# Altium schematic sheet STM32F4.SchDoc: STM32F4
size B; Organization: Drexel University; Address1: ECE Senior Design; Address2: 2018-2019; Address3: ECE-08; Revision: 1.0; SheetNumber: 8; SheetTotal: 9
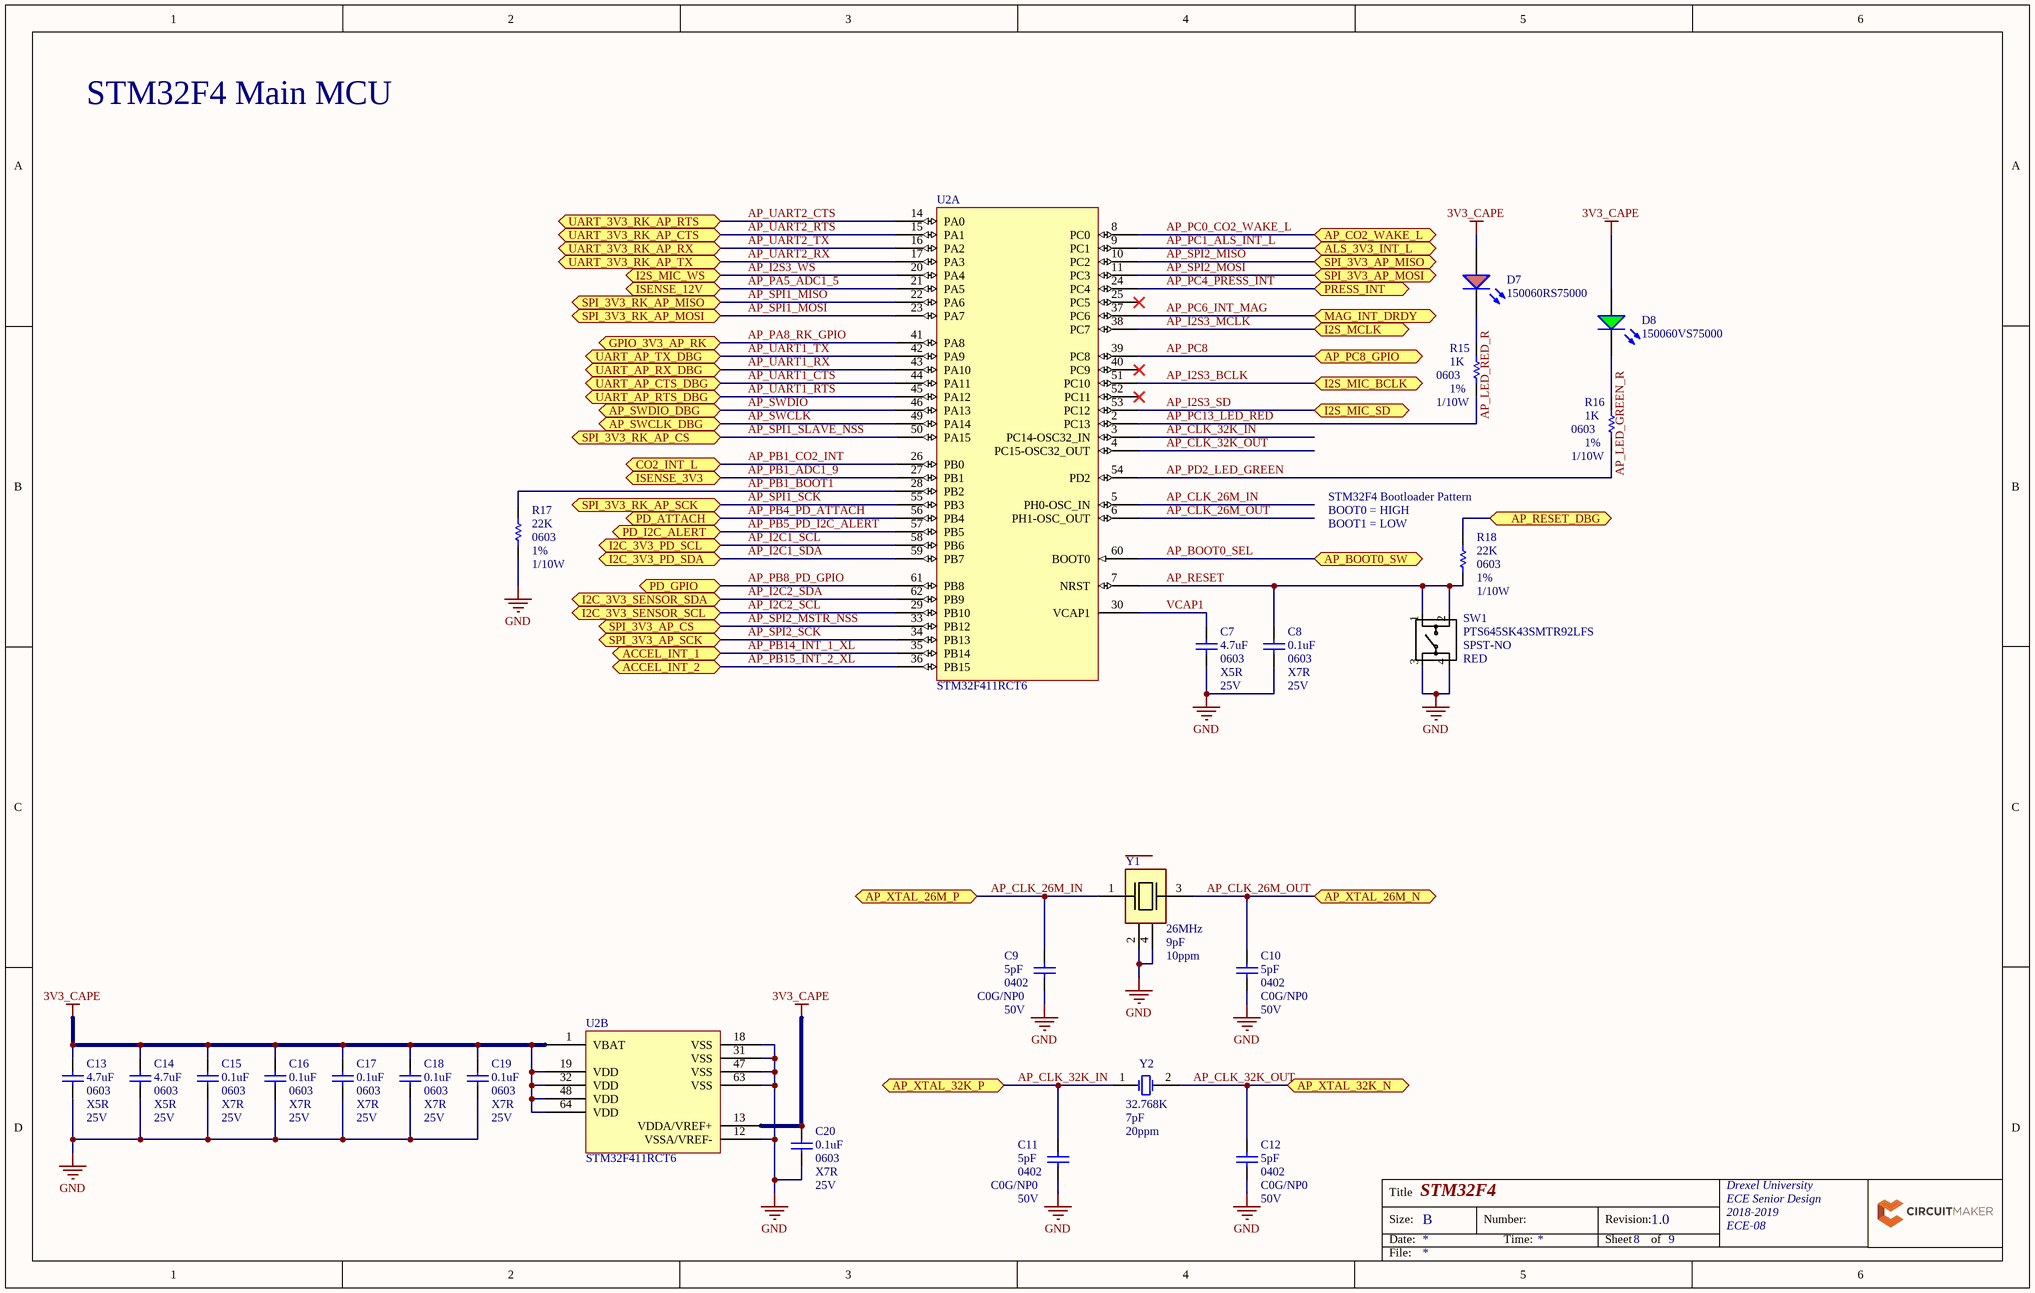
[diagram p0: STM32F4.SchDoc]

## Parts
C7  Capacitance: 4.7uF  Case/Package: 0603  Dielectric Characteristic: X5R  Voltage Rating (DC): 25V  [CAPC1608X90X35ML10T15]  (hidden comment: Murata GRM188R61E475KE11D)
C8  Dielectric Characteristic: X7R  Voltage Rating (DC): 25V  Capacitance: 0.1uF  Package: 0603  [PCB-8usp83j76ntw2xroyu3n-1]  (hidden comment: Würth Elektronik 885012206071)
C9  Capacitance: 5pF  Case/Package: 0402  Dielectric Characteristic: C0G/NP0  Voltage Rating (DC): 50V  [CAPC1005X56X25ML10T15]  (hidden comment: AVX Interconnect / Elco 04025A5R0CAT2A)
C10  Capacitance: 5pF  Case/Package: 0402  Dielectric Characteristic: C0G/NP0  Voltage Rating (DC): 50V  [CAPC1005X56X25ML10T15]  (hidden comment: AVX Interconnect / Elco 04025A5R0CAT2A)
C11  Capacitance: 5pF  Case/Package: 0402  Dielectric Characteristic: C0G/NP0  Voltage Rating (DC): 50V  [CAPC1005X56X25ML10T15]  (hidden comment: AVX Interconnect / Elco 04025A5R0CAT2A)
C12  Capacitance: 5pF  Case/Package: 0402  Dielectric Characteristic: C0G/NP0  Voltage Rating (DC): 50V  [CAPC1005X56X25ML10T15]  (hidden comment: AVX Interconnect / Elco 04025A5R0CAT2A)
C13  Capacitance: 4.7uF  Case/Package: 0603  Dielectric Characteristic: X5R  Voltage Rating (DC): 25V  [CAPC1608X90X35ML10T15]  (hidden comment: Murata GRM188R61E475KE11D)
C14  Capacitance: 4.7uF  Case/Package: 0603  Dielectric Characteristic: X5R  Voltage Rating (DC): 25V  [CAPC1608X90X35ML10T15]  (hidden comment: Murata GRM188R61E475KE11D)
C15  Dielectric Characteristic: X7R  Voltage Rating (DC): 25V  Capacitance: 0.1uF  Package: 0603  [PCB-8usp83j76ntw2xroyu3n-1]  (hidden comment: Würth Elektronik 885012206071)
C16  Dielectric Characteristic: X7R  Voltage Rating (DC): 25V  Capacitance: 0.1uF  Package: 0603  [PCB-8usp83j76ntw2xroyu3n-1]  (hidden comment: Würth Elektronik 885012206071)
C17  Dielectric Characteristic: X7R  Voltage Rating (DC): 25V  Capacitance: 0.1uF  Package: 0603  [PCB-8usp83j76ntw2xroyu3n-1]  (hidden comment: Würth Elektronik 885012206071)
C18  Dielectric Characteristic: X7R  Voltage Rating (DC): 25V  Capacitance: 0.1uF  Package: 0603  [PCB-8usp83j76ntw2xroyu3n-1]  (hidden comment: Würth Elektronik 885012206071)
C19  Dielectric Characteristic: X7R  Voltage Rating (DC): 25V  Capacitance: 0.1uF  Package: 0603  [PCB-8usp83j76ntw2xroyu3n-1]  (hidden comment: Würth Elektronik 885012206071)
C20  Dielectric Characteristic: X7R  Voltage Rating (DC): 25V  Capacitance: 0.1uF  Package: 0603  [PCB-8usp83j76ntw2xroyu3n-1]  (hidden comment: Würth Elektronik 885012206071)
D7  150060RS75000  [PCB-gaza7c7mdlgwi4y82xs2-1]
D8  150060VS75000  [0603_A]
R15  Case/Package: 0603  Power Rating: 1/10W  Resistance: 1K  Resistance Tolerance: 1%  [PCB-rzdzs5ckhrcob8ss0hvn-1]  (hidden comment: Stackpole Electronics RMCF0603FT1K00)
R16  Case/Package: 0603  Power Rating: 1/10W  Resistance: 1K  Resistance Tolerance: 1%  [PCB-rzdzs5ckhrcob8ss0hvn-1]  (hidden comment: Stackpole Electronics RMCF0603FT1K00)
R17  Resistance: 22K  Resistance Tolerance: 1%  Case/Package: 0603  Power Rating: 1/10W  [RESC1608X55X25LL10T15]  (hidden comment: Yageo RC0603FR-0722KL)
R18  Resistance: 22K  Resistance Tolerance: 1%  Case/Package: 0603  Power Rating: 1/10W  [RESC1608X55X25LL10T15]  (hidden comment: Yageo RC0603FR-0722KL)
SW1  Manufacturer Part Number: PTS645SK43SMTR92LFS  Contacts Type: SPST-NO  [PCB-2l25iuk5dcek232nr8ss-1]  (hidden comment: C&K Components PTS645SK43SMTR92LFS)
U2  STM32F411RCT6  [STM32F411RCT6]  (parts A,B of 2)
Y1  Frequency: 26MHz  Load Capacitance: 9pF  Tolerance: 10ppm  [PCB-rtr9ii3g7ib08042rvg2-1]  (hidden comment: EPSON TSX-3225 26.0000MF09Z-AC0)
Y2  Frequency: 32.768K  Load Capacitance: 7pF  Tolerance: 20ppm  [PCB-1zp5wd1v5813cd8flxka-1]  (hidden comment: SYM-533e9910b4df8cf9-1)

## Ports
ACCEL_INT_1, ACCEL_INT_2, ALS_3V3_INT_L, AP_BOOT0_SW, AP_CO2_WAKE_L, AP_PC8_GPIO, AP_RESET_DBG, AP_SWCLK_DBG, AP_SWDIO_DBG, AP_XTAL_26M_N, AP_XTAL_26M_P, AP_XTAL_32K_N, AP_XTAL_32K_P, CO2_INT_L, GPIO_3V3_AP_RK, I2C_3V3_PD_SCL (bidir), I2C_3V3_PD_SDA (bidir), I2C_3V3_SENSOR_SCL, I2C_3V3_SENSOR_SDA, I2S_MCLK, I2S_MIC_BCLK, I2S_MIC_SD, I2S_MIC_WS, ISENSE_3V3, ISENSE_12V, MAG_INT_DRDY, PD_ATTACH, PD_GPIO, PD_I2C_ALERT, PRESS_INT, SPI_3V3_AP_CS, SPI_3V3_AP_MISO, SPI_3V3_AP_MOSI, SPI_3V3_AP_SCK, SPI_3V3_RK_AP_CS, SPI_3V3_RK_AP_MISO, SPI_3V3_RK_AP_MOSI, SPI_3V3_RK_AP_SCK, UART_3V3_RK_AP_CTS (bidir), UART_3V3_RK_AP_RTS (bidir), UART_3V3_RK_AP_RX, UART_3V3_RK_AP_TX, UART_AP_CTS_DBG, UART_AP_RTS_DBG, UART_AP_RX_DBG, UART_AP_TX_DBG

## Nets
3V3_CAPE: C13.2 C14.2 C15.2 C16.2 C17.2 C18.2 C19.2 C20.2 D7.2(A) D8.2(A) U2.1(VBAT) U2.13(VDDA/VREF+) U2.19(VDD) U2.32(VDD) U2.48(VDD) U2.64(VDD)
GND: C7.1 C8.1 C9.1 C10.1 C11.1 C12.1 C13.1 C14.1 C15.1 C16.1 C17.1 C18.1 C19.1 C20.1 R17.1 SW1.3 SW1.4 U2.12(VSSA/VREF-) U2.18(VSS) U2.31(VSS) U2.47(VSS) U2.63(VSS) Y1.2(GND) Y1.4(GND)
AP_BOOT0_SEL: U2.60(BOOT0) ; port AP_BOOT0_SW
AP_CLK_26M_IN: C9.2 U2.5(PH0-OSC_IN) Y1.1(X1) ; port AP_XTAL_26M_P
AP_CLK_26M_OUT: C10.2 U2.6(PH1-OSC_OUT) Y1.3(X2) ; port AP_XTAL_26M_N
AP_CLK_32K_IN: C11.2 U2.3(PC14-OSC32_IN) Y2.1(X1) ; port AP_XTAL_32K_P
AP_CLK_32K_OUT: C12.2 U2.4(PC15-OSC32_OUT) Y2.2(X2) ; port AP_XTAL_32K_N
AP_I2C1_SCL: U2.58(PB6) ; port I2C_3V3_PD_SCL
AP_I2C1_SDA: U2.59(PB7) ; port I2C_3V3_PD_SDA
AP_I2C2_SCL: U2.29(PB10) ; port I2C_3V3_SENSOR_SCL
AP_I2C2_SDA: U2.62(PB9) ; port I2C_3V3_SENSOR_SDA
AP_I2S3_BCLK: U2.51(PC10) ; port I2S_MIC_BCLK
AP_I2S3_MCLK: U2.38(PC7) ; port I2S_MCLK
AP_I2S3_SD: U2.53(PC12) ; port I2S_MIC_SD
AP_I2S3_WS: U2.20(PA4) ; port I2S_MIC_WS
AP_LED_GREEN_R: D8.1(K) R16.2
AP_LED_RED_R: D7.1(K) R15.2
AP_PA5_ADC1_5: U2.21(PA5) ; port ISENSE_12V
AP_PA8_RK_GPIO: U2.41(PA8) ; port GPIO_3V3_AP_RK
AP_PB1_ADC1_9: U2.27(PB1) ; port ISENSE_3V3
AP_PB1_BOOT1: R17.2 U2.28(PB2)
AP_PB1_CO2_INT: U2.26(PB0) ; port CO2_INT_L
AP_PB4_PD_ATTACH: U2.56(PB4) ; port PD_ATTACH
AP_PB5_PD_I2C_ALERT: U2.57(PB5) ; port PD_I2C_ALERT
AP_PB8_PD_GPIO: U2.61(PB8) ; port PD_GPIO
AP_PB14_INT_1_XL: U2.35(PB14) ; port ACCEL_INT_1
AP_PB15_INT_2_XL: U2.36(PB15) ; port ACCEL_INT_2
AP_PC0_CO2_WAKE_L: U2.8(PC0) ; port AP_CO2_WAKE_L
AP_PC1_ALS_INT_L: U2.9(PC1) ; port ALS_3V3_INT_L
AP_PC4_PRESS_INT: U2.24(PC4) ; port PRESS_INT
AP_PC6_INT_MAG: U2.37(PC6) ; port MAG_INT_DRDY
AP_PC8: U2.39(PC8) ; port AP_PC8_GPIO
AP_PC13_LED_RED: R15.1 U2.2(PC13)
AP_PD2_LED_GREEN: R16.1 U2.54(PD2)
AP_RESET: C8.2 R18.1 SW1.1 SW1.2 U2.7(NRST)
AP_RESET_DBG: R18.2 ; port AP_RESET_DBG
AP_SPI1_MISO: U2.22(PA6) ; port SPI_3V3_RK_AP_MISO
AP_SPI1_MOSI: U2.23(PA7) ; port SPI_3V3_RK_AP_MOSI
AP_SPI1_SCK: U2.55(PB3) ; port SPI_3V3_RK_AP_SCK
AP_SPI1_SLAVE_NSS: U2.50(PA15) ; port SPI_3V3_RK_AP_CS
AP_SPI2_MISO: U2.10(PC2) ; port SPI_3V3_AP_MISO
AP_SPI2_MOSI: U2.11(PC3) ; port SPI_3V3_AP_MOSI
AP_SPI2_MSTR_NSS: U2.33(PB12) ; port SPI_3V3_AP_CS
AP_SPI2_SCK: U2.34(PB13) ; port SPI_3V3_AP_SCK
AP_SWCLK: U2.49(PA14) ; port AP_SWCLK_DBG
AP_SWDIO: U2.46(PA13) ; port AP_SWDIO_DBG
AP_UART1_CTS: U2.44(PA11) ; port UART_AP_CTS_DBG
AP_UART1_RTS: U2.45(PA12) ; port UART_AP_RTS_DBG
AP_UART1_RX: U2.43(PA10) ; port UART_AP_RX_DBG
AP_UART1_TX: U2.42(PA9) ; port UART_AP_TX_DBG
AP_UART2_CTS: U2.14(PA0) ; port UART_3V3_RK_AP_RTS
AP_UART2_RTS: U2.15(PA1) ; port UART_3V3_RK_AP_CTS
AP_UART2_RX: U2.17(PA3) ; port UART_3V3_RK_AP_TX
AP_UART2_TX: U2.16(PA2) ; port UART_3V3_RK_AP_RX
VCAP1: C7.2 U2.30(VCAP1)

Not connected (* = marked no-connect by the designer): U2 25(PC5)* 40(PC9)* 52(PC11)*

## Notes on the sheet
- STM32F4 Main MCU
- (near R18) STM32F4 Bootloader Pattern
- BOOT0 = HIGH
- BOOT1 = LOW
- (near SW1) RED
- Title
- Size:
- Date:
- B
- Number:
- Time:
- Revision:
- Sheet
- of
- File:

## Library data of the parts
C7 C13 C14 = CMP-8856396-4: CAP CER 4.7UF 25V 10% X5R 0603; Capacitance Tolerance: ±10%; Lifecycle Status: Active; Octopart Url: https://octopart.com/grm188r61e475ke11d-murata-26982327; OctopartID: 0176c9e793a7deb1; Packaging: Cut Tape (CT); REACH SVHC Compliance: No SVHC; RoHS: Compliant; Size-Length: 0.0016 m; Size-Thickness: 0.0008 m; Size-Width: 0.0008 m; Manufacturer Part Number: GRM188R61E475KE11D
C8 C15-C20 = CMP-034ac9768ab0dc8d-1: Multilayer Ceramic Capacitor, WCAP-CSGP Series, 0.1 F, 10%, X7R, 25 V, 0603 [1608 Metric]; RoHS: Compliant; Capacitance Tolerance: ±10%; OctopartID: 034ac9768ab0dc8d; Packaging: Cut Tape (CT); Octopart URL: http://octopart.com/885012206071-w%C3%BCrth+elektronik-53914780; Manufacturer Part Number: 885012206071
C9-C12 = CMP-173336-2: Multilayer Ceramic Capacitors MLCC - SMD/SMT 0402 5pF 50volts C0G +/-0.25pF; Lead-Free Status: Lead Free; Octopart Url: https://octopart.com/04025a5r0cat2a-avx+interconnect+%2F+elco-9080176; OctopartID: 46528fd2ee449995; Packaging: Tape; RoHS: Compliant; Manufacturer Part Number: 04025A5R0CAT2A
D7 = CMP-12518859-4: Standard LEDs - SMD WL-SMCW SMDMono TpVw Waterclr 0603 Red; Luminous Intensity: 250 mcd; Viewing Angle: 140 °; Forward Voltage: 2.00 V; Case/Package: 0603; Manufacturer Part Number: 150060RS75000; Packaging: Cut Tape (CT); Octopart URL: https://octopart.com/150060rs75000-w%C3%BCrth+elektronik-29717776; Mounting Style: Surface Mount; REACH SVHC Compliance: No SVHC; OctopartID: 47368ff9174098f1; Color: Red
D8 = CMP-12518862-3: SMD mono-color Chip LED, WL-SMCW, Bright Green; Forward Voltage: 2.0 V; Luminous Intensity: 0.04 cd; Viewing Angle: 140 °; Octopart Url: https://octopart.com/150060vs75000-w%C3%BCrth+elektronik-29717778; OctopartID: 8ccb4404dcbf530c; REACH SVHC Compliance: No SVHC; RoHS: Compliant; Manufacturer Part Number: 150060VS75000
R15 R16 = CMP-fdb3359cf2042274-2: RMCF Series 0603 0.1 W 1 kOhm ±1 % ±100 ppm/°C SMT Thick Film Chip Resistor; Lead-Free Status: Lead Free; Packaging: Tape & Reel (TR); Octopart URL: http://octopart.com/rmcf0603ft1k00-stackpole+electronics-19213009; Mounting Style: Surface Mount; OctopartID: fdb3359cf2042274; RoHS: Compliant; Manufacturer Part Number: RMCF0603FT1K00
R17 R18 = CMP-1853446-5: Chip Resistor, 22 KOhm, +/- 1%, 0.1 W, -55 to 155 degC, 0603 (1608 Metric), RoHS, Tape and Reel; Voltage Rating (DC): 50.0 V; Lead-Free Status: Lead Free; Case/Package (SI): 1608; Number of Pins: 2; Size-Height: 450 µm; PackageDescription: 2-Pin Surface Mount Device, Body 1.6 x 0.8 mm; Size-Width: 800 µm; Seller Landing  Url: https://octopart-clicks.com/click/track?country=US&ak=8157f166&sig=0952a08&sid=5489&ppid=40952860&vpid=270386233&ct=offers; DatasheetVersion: Rev. 4, 02/2016; PackageReference: 0603; Size-Length: 1.60 mm; RoHS: Compliant; Mounting Style: Surface Mount; OctopartID: 2162ea18e018fea5; Manufacturer Part Number: RC0603FR-0722KL; Packaging: Cut Tape (CT), Tape & Reel (TR); Octopart Url: http://octopart.com/rc0603fr-0722kl-yageo-40952860; REACH SVHC Compliance: No SVHC
SW1 = CMP-8f9845df1015505f-1: Switch Tactile N.O SPST Round Button Gull Wing 0.05A 12VDC 100000Cycle 2.55N SMD T/R; Lead-Free Status: Lead Free; Octopart URL: https://octopart.com/pts645sk43smtr92lfs-c%26k+components-55425771; Mounting Style: Surface Mount; Packaging: Tape & Reel (TR); REACH SVHC Compliance: No SVHC; RoHS: Compliant; Size-Height: 4.30 mm; OctopartID: 8f9845df1015505f
U2 = CMP-a3dd6807c7d17c1a-3: 32 Bit Microcontroller, Batch Acquisition Mode, ARM Cortex-M4, 100 MHz, 256 KB, 128 KB, 64, LQFP
Y1 = CMP-fc563492a5642391-2: Crystal 26.00 Mhz 9.0pf Smd; Manufacturer Part Number: TSX-3225 26.0000MF09Z-AC0
Y2 = CMP-533e9910b4df8cf9-1: Crystal 0.032768MHz ±20ppm (Tol) 7pF FUND 70000Ohm 2-Pin SMD T/R; Manufacturer Part Number: FC-135 32.7680KA-AG0; Packaging: Reel; RoHS: Compliant; OctopartID: 533e9910b4df8cf9; Octopart URL: http://octopart.com/fc-135+32.7680ka-ag0-epson-52740743